# Altium project Arduino_Nano.PrjPcb
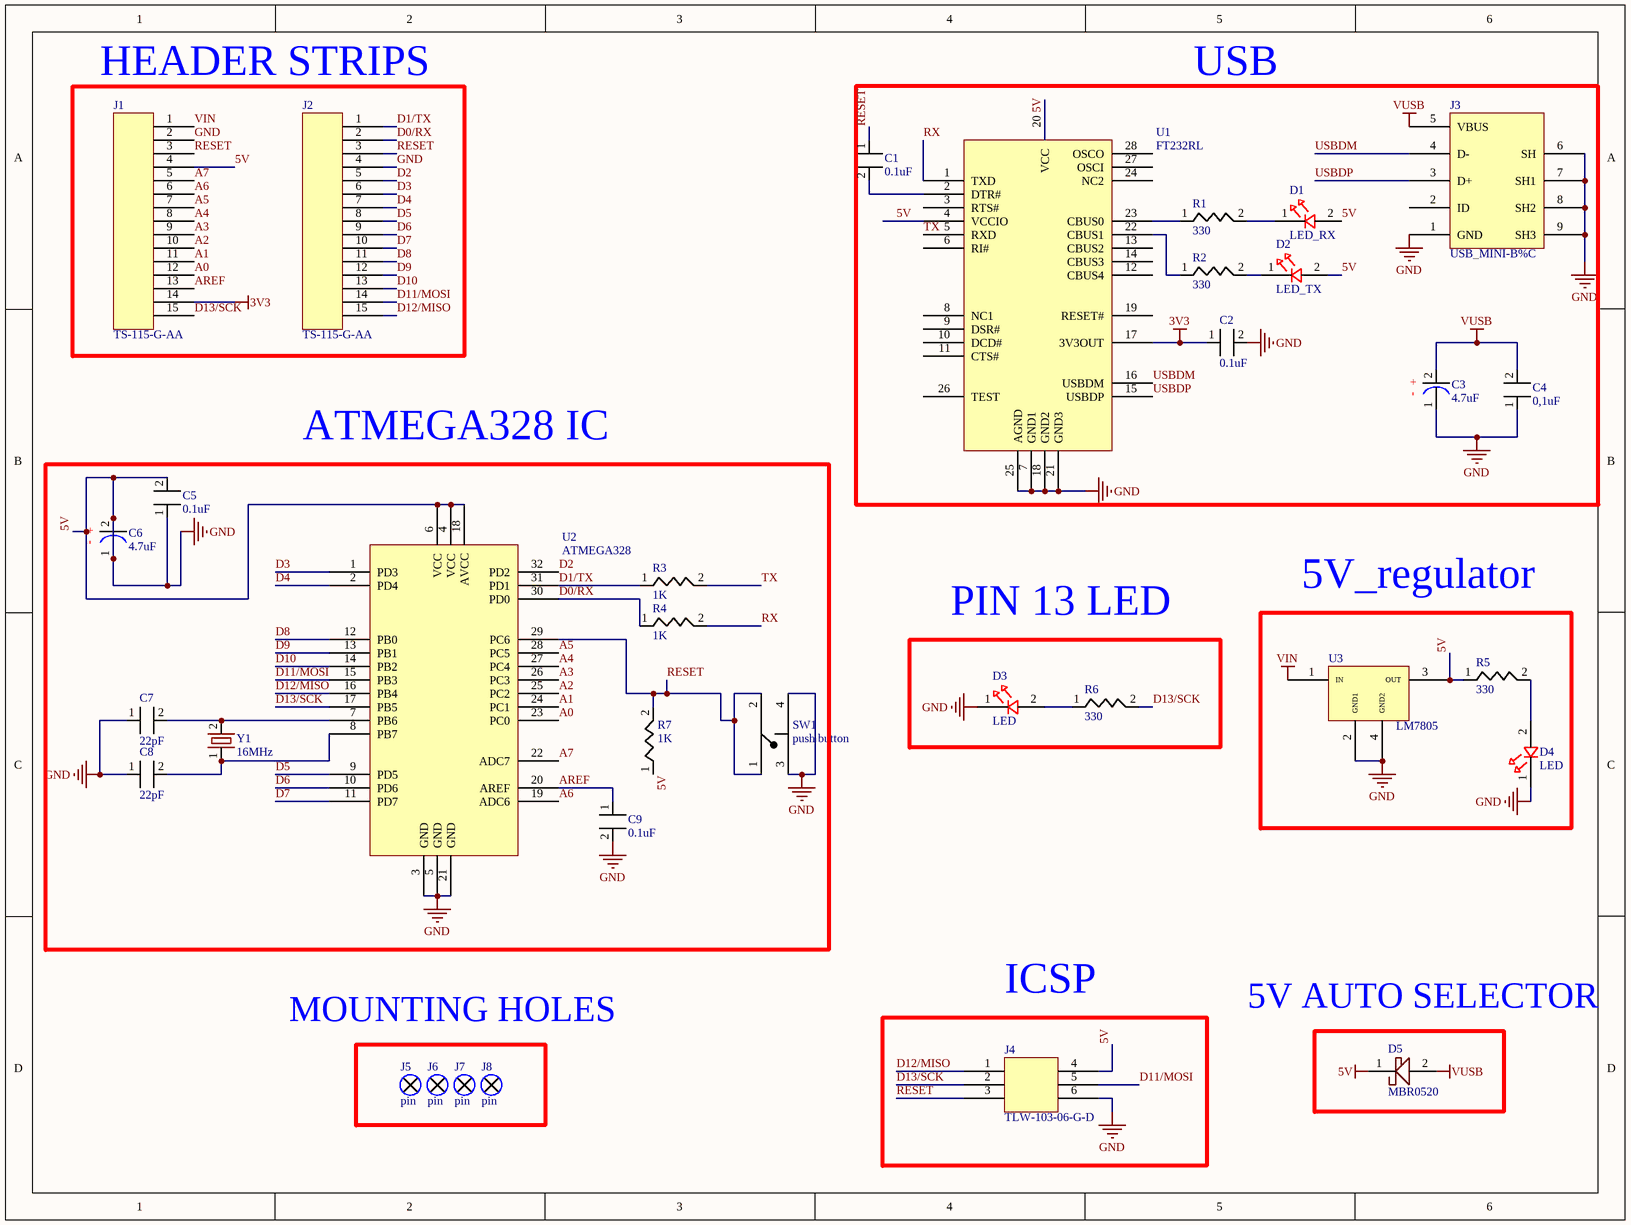
[diagram p0: Sheet1.SchDoc]
1 sheet, 34 parts. Net scope: global (net labels, ports and power ports of the same name join across sheets).
Board file: PCB1.PcbDoc

## Sheet Sheet1.SchDoc
size 304 x 228 mm; SheetNumber: 1; SheetTotal: 1

### Parts
C1  0.1uF  [Capacitor]
C2  0.1uF  [Capacitor]
C3  4.7uF  [polar Capacitor]
C4  0,1uF  [Capacitor]
C5  0.1uF  [Capacitor]
C6  4.7uF  [polar Capacitor]
C7  22pF  [Capacitor]
C8  22pF  [Capacitor]
C9  0.1uF  [Capacitor]
D1  LED_RX  [LED]
D2  LED_TX  [LED]
D3  LED  [LED]
D4  LED  [LED]
D5  MBR0520  [MBR0520]
J1  TS-115-G-AA  [PCBComponent_1]
J2  TS-115-G-AA  [PCBComponent_1]
J3  USB_MINI-B%C  [USB MINI_B]
J4  TLW-103-06-G-D  [pin header3x2]
J5  pin  [PIN]
J6  pin  [PIN]
J7  pin  [PIN]
J8  pin  [PIN]
R1  330  [Resistor]
R2  330  [Resistor]
R3  1K  [Resistor]
R4  1K  [Resistor]
R5  330  [Resistor]
R6  330  [Resistor]
R7  1K  [Resistor]
SW1  push button  [push button]
U1  FT232RL  [FT232RL]
U2  ATMEGA328  [ATMEGEA328]
U3  LM7805  [LM7805]
Y1  16MHz  [crystal - duplicate]

### Blocks framed on the sheet
HEADER STRIPS: J1 J2
USB: C1-C4 D1 D2 J3 R1 R2 U1
ATMEGA328 IC: C5-C9 R3 R4 R7 SW1 U2 Y1
PIN 13 LED: D3 R6
5V_regulator: D4 R5 U3
ICSP: J4

### Nets
3V3: C2.1 J1.14 U1.17(3V3OUT)
5V: C2.2 C3.1 C4.1 C5.1 C5.2 C6.1 C6.2 C7.1 C8.1 C9.2 D1.2 D2.2 D3.1 D4.1 D5.1 J1.2 J1.4 J2.4 J3.1(GND) J3.6(SH) J3.7(SH1) J3.8(SH2) J3.9(SH3) J4.4 J4.6 R5.1 R7.1 SW1.3 SW1.4 U1.4(VCCIO) U1.7(GND1) U1.18(GND2) U1.20(VCC) U1.21(GND3) U1.25(AGND) U2.3(GND) U2.4(VCC) U2.5(GND) U2.6(VCC) U2.18(AVCC) U2.21(GND) U3.2(GND1) U3.3(OUT) U3.4(GND2)  [also labelled GND]
VIN: J1.1 U3.1(IN)
VUSB: C3.2 C4.2 D5.2 J3.5(VBUS)
A0: J1.12 U2.23(PC0)
A1: J1.11 U2.24(PC1)
A2: J1.10 U2.25(PC2)
A3: J1.9 U2.26(PC3)
A4: J1.8 U2.27(PC4)
A5: J1.7 U2.28(PC5)
A6: J1.6 U2.19(ADC6)
A7: J1.5 U2.22(ADC7)
AREF: C9.1 J1.13 U2.20(AREF)
D0/RX: J2.2 R4.1 U2.30(PD0)
D1/TX: J2.1 R3.1 U2.31(PD1)
D2: J2.5 U2.32(PD2)
D3: J2.6 U2.1(PD3)
D4: J2.7 U2.2(PD4)
D5: J2.8 U2.9(PD5)
D6: J2.9 U2.10(PD6)
D7: J2.10 U2.11(PD7)
D8: J2.11 U2.12(PB0)
D9: J2.12 U2.13(PB1)
D10: J2.13 U2.14(PB2)
D11/MOSI: J2.14 J4.5 U2.15(PB3)
D12/MISO: J2.15 J4.1 U2.16(PB4)
D13/SCK: J1.15 J4.2 R6.2 U2.17(PB5)
RESET: C1.1 J1.3 J2.3 J4.3 R7.2 SW1.1 SW1.2 U2.29(PC6)
RX: R4.2 U1.1(TXD)
TX: R3.2 U1.5(RXD)
USBDM: J3.4(D-) U1.16(USBDM)
USBDP: J3.3(D+) U1.15(USBDP)
NetC1_2: C1.2 U1.2(DTR#)
NetC7_2: C7.2 U2.7(PB6) Y1.2
NetC8_2: C8.2 U2.8(PB7) Y1.1
NetD1_1: D1.1 R1.2
NetD2_1: D2.1 R2.2
NetD3_2: D3.2 R6.1
NetD4_2: D4.2 R5.2
NetR1_1: R1.1 U1.23(CBUS0)
NetR2_1: R2.1 U1.22(CBUS1)

Not connected (* = marked no-connect by the designer): J3 2(ID); U1 3(RTS#) 6(RI#) 8(NC1) 9(DSR#) 10(DCD#) 11(CTS#) 12(CBUS4) 13(CBUS2) 14(CBUS3) 19(RESET#) 24(NC2) 26(TEST) 27(OSCI) 28(OSCO)

### Notes on the sheet
- MOUNTING HOLES
- 5V AUTO SELECTOR
- (in symbol polarized capcitor) +; -

### Library data of the parts
C1 C2 C4 C5 C7-C9 = capacitor
C3 C6 = polarized capcitor
D1 D2 = LED
J1 J2 = Component_1
J4 = pin header3x2
R1-R7 = resistor
U3 = regulator
Y1 = crystal_dub